# Altium schematic sheet integrated_driver_and_current_sense.SchDoc
size A3
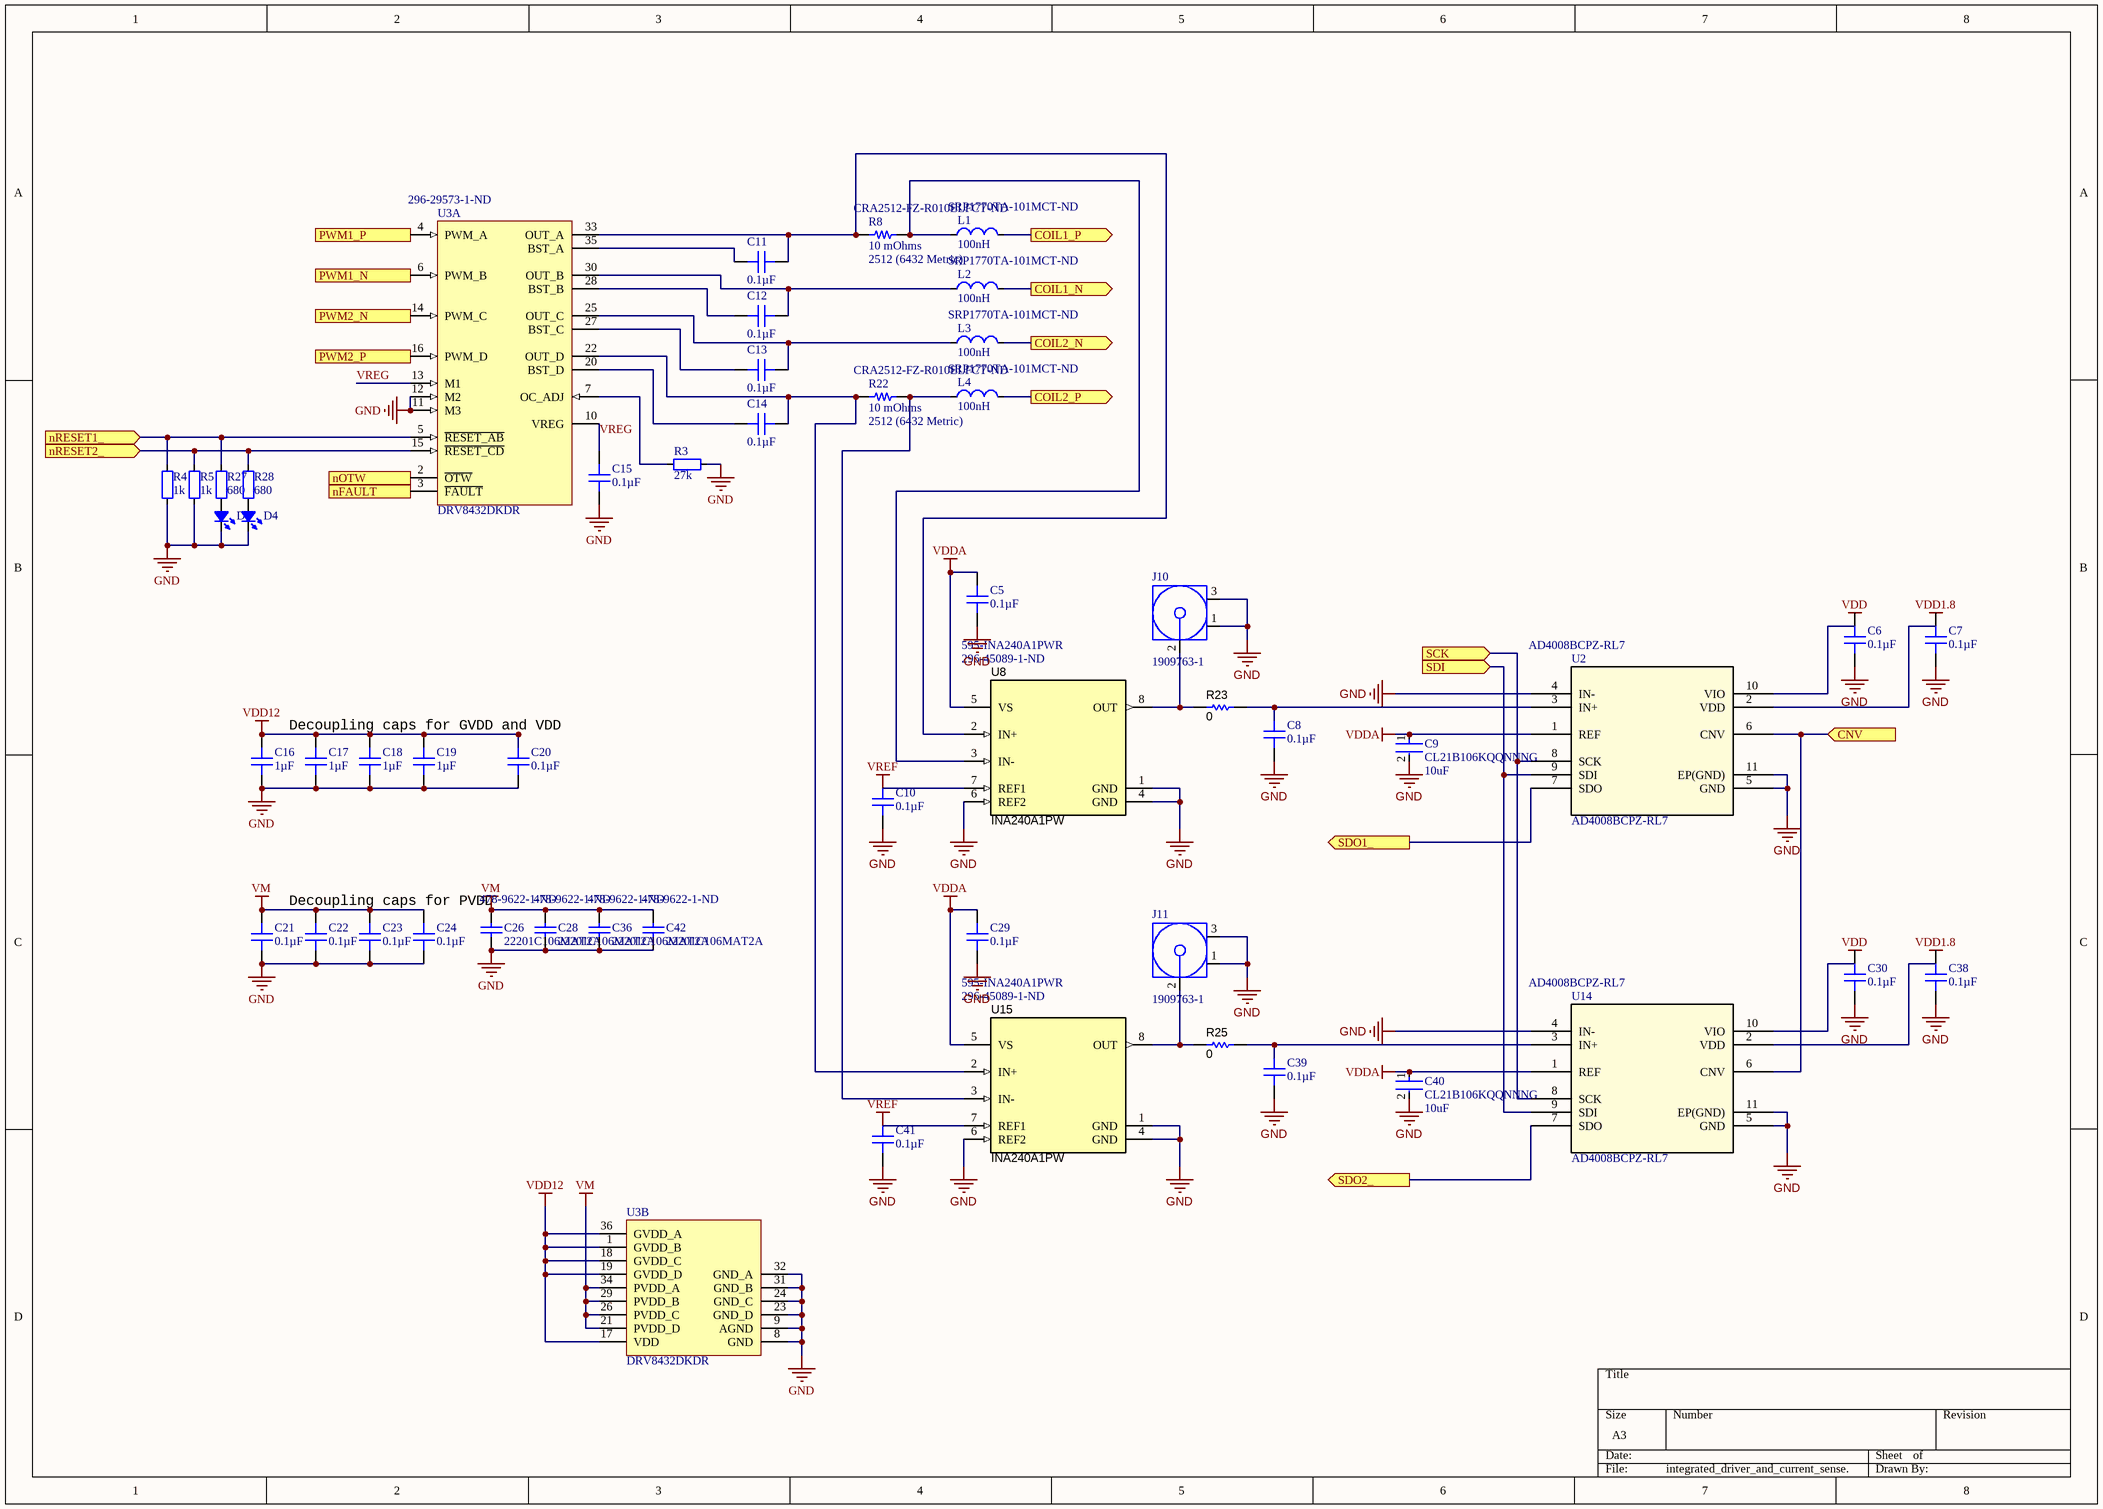
[diagram p0: integrated_driver_and_current_sense.SchDoc]

## Parts
C5  0.1µF  [CAP 0402_1005]
C6  0.1µF  [CAP 0402_1005]
C7  0.1µF  [CAP 0402_1005]
C8  0.1µF  [CAP 0402_1005]
C9  CL21B106KQQNNNG  Capacitance: 10uF  [FP-CL21-IPC_C]
C10  0.1µF  [CAP 0402_1005]
C11  0.1µF  [CAP 0603_1608]
C12  0.1µF  [CAP 0603_1608]
C13  0.1µF  [CAP 0603_1608]
C14  0.1µF  [CAP 0603_1608]
C15  0.1µF  [CAP 0402_1005]
C16  1µF  [CAP 0603_1608]
C17  1µF  [CAP 0603_1608]
C18  1µF  [CAP 0603_1608]
C19  1µF  [CAP 0603_1608]
C20  0.1µF  [CAP 0402_1005]
C21  0.1µF  [CAP 0603_1608]
C22  0.1µF  [CAP 0603_1608]
C23  0.1µF  [CAP 0603_1608]
C24  0.1µF  [CAP 0603_1608]
C26  22201C106MAT2A  Supplier Part Number 1: 478-9622-1-ND  [CAPC5750X279X64NL40T39]
C28  22201C106MAT2A  Supplier Part Number 1: 478-9622-1-ND  [CAPC5750X279X64NL40T39]
C29  0.1µF  [CAP 0402_1005]
C30  0.1µF  [CAP 0402_1005]
C36  22201C106MAT2A  Supplier Part Number 1: 478-9622-1-ND  [CAPC5750X279X64NL40T39]
C38  0.1µF  [CAP 0402_1005]
C39  0.1µF  [CAP 0402_1005]
C40  CL21B106KQQNNNG  Capacitance: 10uF  [FP-CL21-IPC_C]
C41  0.1µF  [CAP 0402_1005]
C42  22201C106MAT2A  Supplier Part Number 1: 478-9622-1-ND  [CAPC5750X279X64NL40T39]
D3  LED_0402  [LED_0402_RED]  (value not drawn)
D4  LED_0402  [LED_0402_RED]  (value not drawn)
J10  1909763-1  [TECO-1909763-1_V]
J11  1909763-1  [TECO-1909763-1_V]
L1  value 100nH  Supplier Part Number 1: SRP1770TA-101MCT-ND  [SRP1770TA]
L2  value 100nH  Supplier Part Number 1: SRP1770TA-101MCT-ND  [SRP1770TA]
L3  value 100nH  Supplier Part Number 1: SRP1770TA-101MCT-ND  [SRP1770TA]
L4  value 100nH  Supplier Part Number 1: SRP1770TA-101MCT-ND  [SRP1770TA]
R3  value 27k  [RES_0402]  (hidden comment: Res_0402)
R4  value 1k  [RES_0805]  (hidden comment: Res_0805)
R5  value 1k  [RES_0805]  (hidden comment: Res_0805)
R8  10 mOhms  Package / Case: 2512 (6432 Metric)  Supplier Part Number 1: CRA2512-FZ-R010ELFCT-ND  [STACKPOLE CSR2512]
R22  10 mOhms  Package / Case: 2512 (6432 Metric)  Supplier Part Number 1: CRA2512-FZ-R010ELFCT-ND  [STACKPOLE CSR2512]
R23  ValueDisplayed: 0  [RES_0402]  (hidden comment: CRCW04020000Z0ED)
R25  ValueDisplayed: 0  [RES_0402]  (hidden comment: CRCW04020000Z0ED)
R27  value 680  [RES_0402]  (hidden comment: Res_0402)
R28  value 680  [RES_0402]  (hidden comment: Res_0402)
U2  AD4008BCPZ-RL7  [CP_10_9]
U3  DRV8432DKDR  Supplier Part Number 1: 296-29573-1-ND  [DKD0036A_N]  (parts A,B of 2)
U8  INA240A1PW  Supplier Part Number 1: 296-45089-1-ND  Supplier Part Number 2: 595-INA240A1PWR  [PW0008A_N]
U14  AD4008BCPZ-RL7  [CP_10_9]
U15  INA240A1PW  Supplier Part Number 1: 296-45089-1-ND  Supplier Part Number 2: 595-INA240A1PWR  [PW0008A_N]

## Ports
CNV (in), COIL1_N (out), COIL1_P (out), COIL2_N (out), COIL2_P (out), nFAULT (out), nOTW (out), nRESET1_ (in), nRESET2_ (in), PWM1_N (in), PWM1_P (in), PWM2_N (in), PWM2_P (in), SCK (in), SDI (in), SDO1_ (out), SDO2_ (out)

## Nets
GND: C5.2 C6.2 C7.2 C8.2 C9.2 C10.2 C15.2 C16.2 C17.2 C18.2 C19.2 C20.2 C21.2 C22.2 C23.2 C24.2 C26.2 C28.2 C29.2 C30.2 C36.2 C38.2 C39.2 C40.2 C41.2 C42.2 D3.2(K) D4.2(K) J10.1 J10.3 J11.1 J11.3 R3.2 R4.1 R5.1 U2.4(IN-) U2.5(GND) U2.11(EP(GND)) U3.8(GND) U3.9(AGND) U3.11(M3) U3.12(M2) U3.23(GND_D) U3.24(GND_C) U3.31(GND_B) U3.32(GND_A) U8.1(GND) U8.4(GND) U8.6(REF2) U14.4(IN-) U14.5(GND) U14.11(EP(GND)) U15.1(GND) U15.4(GND) U15.6(REF2)
VDD: U2.10(VIO) U14.10(VIO)
VDD1.8: U2.2(VDD) U14.2(VDD)
VDD12: C16.1 C17.1 C18.1 C19.1 C20.1 U3.1(GVDD_B) U3.17(VDD) U3.18(GVDD_C) U3.19(GVDD_D) U3.36(GVDD_A)
VDDA: C5.1 C9.1 C29.1 C40.1 U2.1(REF) U8.5(VS) U14.1(REF) U15.5(VS)
VM: C21.1 C22.1 C23.1 C24.1 C26.1 C28.1 C36.1 C42.1 U3.21(PVDD_D) U3.26(PVDD_C) U3.29(PVDD_B) U3.34(PVDD_A)
VREF: U8.7(REF1) U15.7(REF1)
CNV: U2.6(CNV) U14.6(CNV) ; port CNV
COIL1_N: L2.2 ; port COIL1_N
COIL1_P: L1.2 ; port COIL1_P
COIL2_N: L3.2 ; port COIL2_N
COIL2_P: L4.2 ; port COIL2_P
nFAULT: U3.3(~{FAULT}) ; port nFAULT
nOTW: U3.2(~{OTW}) ; port nOTW
nRESET1_: R4.2 R27.2 U3.5(~{RESET_AB}) ; port nRESET1_
nRESET2_: R5.2 R28.2 U3.15(~{RESET_CD}) ; port nRESET2_
PWM1_N: U3.6(PWM_B) ; port PWM1_N
PWM1_P: U3.4(PWM_A) ; port PWM1_P
PWM2_N: U3.14(PWM_C) ; port PWM2_N
PWM2_P: U3.16(PWM_D) ; port PWM2_P
SCK: U2.8(SCK) U14.8(SCK) ; port SCK
SDI: U2.9(SDI) U14.9(SDI) ; port SDI
SDO1_: U2.7(SDO) ; port SDO1_
SDO2_: U14.7(SDO) ; port SDO2_
VREG: C15.1 U3.10(VREG) U3.13(M1)
NetC8_1: C8.1 R23.1 U2.3(IN+)
NetC11_1: C11.1 U3.35(BST_A)
NetC11_2: C11.2 R8.1 U3.33(OUT_A) U8.2(IN+)
NetC12_1: C12.1 U3.28(BST_B)
NetC12_2: C12.2 L2.1 U3.30(OUT_B)
NetC13_1: C13.1 U3.27(BST_C)
NetC13_2: C13.2 L3.1 U3.25(OUT_C)
NetC14_1: C14.1 U3.20(BST_D)
NetC14_2: C14.2 R22.1 U3.22(OUT_D) U15.2(IN+)
NetC39_1: C39.1 R25.1 U14.3(IN+)
NetD3_1: D3.1(A) R27.1
NetD4_1: D4.1(A) R28.1
NetJ10_2: J10.2 R23.2 U8.8(OUT)
NetJ11_2: J11.2 R25.2 U15.8(OUT)
NetL1_1: L1.1 R8.2 U8.3(IN-)
NetL4_1: L4.1 R22.2 U15.3(IN-)
NetR3_1: R3.1 U3.7(OC_ADJ)

Not connected (* = marked no-connect by the designer): C6 1; C7 1; C10 1; C30 1; C38 1; C41 1

## Notes on the sheet
- Decoupling caps for GVDD and VDD
- Decoupling caps for PVDD

## Library data of the parts
C5-C8 C10 C15 C20 C29 C30 C38 C39 C41 = 04023C104KAT2A: CAP CER 0.1UF 25V X7R 0402; Manufacturer: AVX Corporation; Tolerance: ±10%; Value: 0.1µF; ComponentLink1Description: Datasheet; ComponentLink1URL: http://datasheets.avx.com/X7RDielectric.pdf; Supplier 1: DigiKey; Supplier Part Number 1: 478-7868-1-ND; Part Number: 04023C104KAT2A; Applications: General Purpose; Capacitance: 0.1µF; ComponentLink2Description: DigiKey Link; ComponentLink2URL: http://digikey.com/product-detail/en/avx-corporation/04023C104KAT2A/478-7868-1-ND/3881491; Device Package: 0402 (1005 Metric); LastUpdated: 9/2/2020 1:02:21 AM; Lifecycle Status: Active; Minimum Order: 1; Mounting Type: Surface Mount, MLCC; Operating Temperature: -55°C ~ 125°C; Package / Case: 0402 (1005 Metric); Packaging: CutTape; PartId: 3190; Part Status: Active; Price: 0.13; Series: -; Size / Dimension: 0.039" L x 0.020" W (1.00mm x 0.50mm); Temperature Coefficient: X7R; Thickness (Max): 0.022" (0.55mm); Voltage - Rated: 25V
C9 C40 = CMP-13271-001427-1: CL21 Series 0805 10uF 6.3V ±10% Tolerance X7R Multilayer Ceramic Chip Capacitor; Min Operating Temperature: -55°C; Dielectric: X7R; Voltage Rating: 6.3V; Case/Package: 0805; Height: 1.25mm; Case Code (Metric): 2012; Tolerance: 10%; Packaging: Tape and Reel; Thickness: 0.055inch; Voltage: 6.3V; Max Operating Temperature: 125°C; Lead Free: Lead Free; Package Quantity: 3000; Case Code (Imperial): 0805; Depth: 1.25mm; Width: 0.049inch; Length: 2mm; Mount: Surface Mount
C11-C14 C21-C24 = 06031C104KAT2A: CAP CER 0.1UF 100V X7R 0603; Manufacturer: AVX Corporation; Tolerance: ±10%; Part Number: 06031C104KAT2A; Value: 0.1µF; Applications: General Purpose; Capacitance: 0.1µF; ComponentLink1Description: Datasheet; ComponentLink1URL: http://datasheets.avx.com/X7RDielectric.pdf; ComponentLink2Description: DigiKey Link; ComponentLink2URL: http://digikey.com/product-detail/en/avx-corporation/06031C104KAT2A/478-10047-1-ND/6564270; Device Package: 0603 (1608 Metric); LastUpdated: 9/2/2020 1:03:14 AM; Lifecycle Status: Active; Minimum Order: 1; Mounting Type: Surface Mount, MLCC; Operating Temperature: -55°C ~ 125°C; Package / Case: 0603 (1608 Metric); Packaging: TapeAndReel; PartId: 14077; Part Status: Active; Price: 0.03; Series: -; Size / Dimension: 0.063" L x 0.032" W (1.60mm x 0.81mm); Supplier 1: DigiKey; Supplier Part Number 1: 478-10047-1-ND; Temperature Coefficient: X7R; Thickness (Max): 0.037" (0.94mm); Voltage - Rated: 100V
C16-C19 = TMK107B7105KA-T: CAP CER 1UF 25V X7R 0603; Manufacturer: Taiyo Yuden; Tolerance: ±10%; Part Number: TMK107B7105KA-T; Value: 1µF; Applications: General Purpose; Capacitance: 1µF; ComponentLink1Description: Datasheet; ComponentLink1URL: https://www.yuden.co.jp/productdata/catalog/mlcc01_e.pdf; ComponentLink2Description: DigiKey Link; ComponentLink2URL: http://digikey.com/product-detail/en/taiyo-yuden/TMK107B7105KA-T/587-2984-1-ND/2714177; Device Package: 0603 (1608 Metric); LastUpdated: 9/2/2020 1:03:30 AM; Lifecycle Status: Active; Minimum Order: 1; Mounting Type: Surface Mount, MLCC; Operating Temperature: -55°C ~ 125°C; Package / Case: 0603 (1608 Metric); Packaging: TapeAndReel; PartId: 5586; Part Status: Active; Price: 0.01; Series: M; Size / Dimension: 0.063" L x 0.031" W (1.60mm x 0.80mm); Supplier 1: DigiKey; Supplier Part Number 1: 587-2984-1-ND; Temperature Coefficient: X7R; Thickness (Max): 0.035" (0.90mm); Voltage - Rated: 25V
C26 C28 C36 C42 = CMP-2000-07534-1: Chip Capacitor, 10 uF, +/- 20%, 100 V, -55 to 125 degC, 2220 (5750 Metric), RoHS, Tape and Reel; Manufacturer: AVX; Description: Cap Ceramic 10uF 100V X7R 20% SMD 2220 125°C Embossed T/R; Capacitance: 10uF; Voltage Rating: 100V; Dielectric: X7R; Datasheet URL: http://datasheets.avx.com/X7RDielectric.pdf; Package Reference: 2220; Package Description: 2-Pin Surface Mount Device, Body 5 x 5.7 mm; Datasheet Version: 03/2017; Manufacturer URL: http://www.avx.com/; Mounting Technology: SurfaceMount; Supplier 1: Digi-Key; Manufacturer Part Number: 22201C106MAT2A; RoHS: Yes; Category: Ceramic Capacitors; Stock 1: 186870; Pricing 1: 1=2.06000, 10=1.66400, 50=1.45200, 100=1.27050 (USD); Mount: Surface Mount; Case/Package: 2220; Case Code (Metric): 5750; Case Code (Imperial): 2220; Min Operating Temperature: -55°C; Max Operating Temperature: 125°C; Packaging: Tape and Reel; Tolerance: 20%; Voltage Rating (DC): 100V; Length: 0.224inch; Width: 0.197inch; Thickness: 0.11inch; RoHS Compliant: Yes; ComponentLink1URL: http://catalogs.avx.com/SurfaceMount.pdf?src-supplier=Digi-Key; ComponentLink1Description: http://catalogs.avx.com/SurfaceMount.pdf?src-supplier=Digi-Key
D3 D4 = LED_0402: LED
J10 J11 = CMP-2000-07505-1: Ultra Miniature Coaxial Connector Jack, 60 V, 50 Ohm, -40 to 90 degC, RoHS, Tape and Reel; Manufacturer: TE Connectivity; Gender: Female; PCB Mounting Orientation: Vertical; Body Material: LiquidCrystalPolymer; Case\/Package: SMD/SMT; Impedance: 50Ohm; Max Frequency: 6GHz; Body Plating: Gold; Dielectric Material: Polymer; Orientation: Straight; Mount: SurfaceMount; Length: 3mm; Packaging: TapeandReel; Connector Type: Jack; Lead Free: LeadFree; Package Quantity: 1; Termination: SMD/SMT; Contact Material: CopperAlloy; Fastening Type: Pull; RoHSCompliant: true; Max Operating Temperature: 90degC; Datasheet URL: http://www.te.com/commerce/DocumentDelivery/DDEController?Action=srchrtrv&DocNm=1909763&DocType=Customer+Drawing&DocLang=English; Contact Plating: Gold; Mounting Technology: SurfaceMount; Package Reference: TECO-1909763-1; Insulation Material: Thermoplastic; Min Operating Temperature: -40degC; Manufacturer URL: http://www.te.com/; ELV: Compliant; Datasheet Version: Rev. B2, 11/2015; Radiation Hardening: No; Package Description: 3-Pin Surface Mount Device, Body 2.6 x 2.6 mm; Housing Colour: Beige
L1-L4 = Ind_0805: FIXED IND 100UH 5.3A 118 MOHM; Manufacturer: TDK; Manufacturer Part Number: MPZ2012S300AT000; Core Material: Ferrite; Impedance: 30R; Current Rating: 6A; DC Resistance (DCR): 10mR; Saturation Current: 6.5A; Shielding: Shielded; Self Resonant Frequency: 2MHz; Test Frequency: 100kHz; Tolerance: 20%; Stock 1: 117704; Pricing 1: 1=0.11, 10=0.091, 25=0.0704, 50=0.0584, 100=0.0503, 250=0.04028, 500=0.03624, 1000=0.0302 (USD); Mount: Surface Mount; Case/Package: 0805; Number of Pins: 3; Case Code (Metric): 2012; Case Code (Imperial): 0805; Packaging: Tape and Reel; Package Quantity: 1; Max DC Current: 6A; Length: 0.079inch; Height: 0.041inch; Width: 0.049inch; Depth: 1.25mm; REACH SVHC: No SVHC; Lead Free: Lead Free; ComponentLink1URL: https://datasheet.ciiva.com/46381/1750041-46381644.pdf; ComponentLink1Description: https://datasheet.ciiva.com/46381/1750041-46381644.pdf; ComponentLink2URL: https://datasheet.ciiva.com/48682/beads-commercial-power-mpz-en-48682508.pdf; ComponentLink2Description: https://datasheet.ciiva.com/48682/beads-commercial-power-mpz-en-48682508.pdf; ComponentLink3URL: https://datasheet.ciiva.com/8077/55169-8077085.pdf; ComponentLink3Description: https://datasheet.ciiva.com/8077/55169-8077085.pdf; ComponentLink4URL: https://datasheet.ciiva.com/8077/55169-8077086.pdf; ComponentLink4Description: https://datasheet.ciiva.com/8077/55169-8077086.pdf; ComponentLink5URL: https://datasheet.ciiva.com/46634/beads-commercial-power-mpz-en-46634590.pdf; ComponentLink5Description: https://datasheet.ciiva.com/46634/beads-commercial-power-mpz-en-46634590.pdf; ComponentLink6URL: https://datasheet.ciiva.com/46634/beads-commercial-power-mpz-en-46634367.pdf; ComponentLink6Description: https://datasheet.ciiva.com/46634/beads-commercial-power-mpz-en-46634367.pdf; RoHS: Yes; Category: Fixed Inductors; Stock 2: 17; Pricing 2: 1=4.17000, 10=3.82200, 25=3.47520, 50=2.91900, 100=2.50200 (USD); Min Operating Temperature: -40°C; Max Operating Temperature: 150°C; Resistor Type: Wirewound; Inductance: 100uH; RMS Current (Irms): 5.3A; Inductance Tolerance: 20%; Height - Seated (Max): 0.276inch; Ratings: AEC-Q200; RoHS Compliant: Yes; ComponentLink7URL: http://www.farnell.com/datasheets/2360566.pdf?src-supplier=Farnell; ComponentLink7Description: http://www.farnell.com/datasheets/2360566.pdf?src-supplier=Farnell; ComponentLink8URL: http://www.farnell.com/datasheets/1955470.pdf?src-supplier=Element14; ComponentLink8Description: http://www.farnell.com/datasheets/1955470.pdf?src-supplier=Element14; ComponentLink9URL: http://www.bourns.com/docs/Product-Datasheets/SRP1770TA.pdf?src-supplier=Digi-Key; ComponentLink9Description: http://www.bourns.com/docs/Product-Datasheets/SRP1770TA.pdf?src-supplier=Digi-Key; ComponentLink10URL: https://www.bourns.com/docs/Product-Datasheets/SRP1770TA.pdf?src-supplier=Digi-Key; ComponentLink10Description: https://www.bourns.com/docs/Product-Datasheets/SRP1770TA.pdf?src-supplier=Digi-Key; Supplier 1: Digi-Key
R3 R27 R28 = Res_0402: Resistor
R4 R5 = Res_0805: Resistor
R8 R22 = TLR3A20ER010FTDG: RES 0.01 OHM 1% 2W 2512; Manufacturer: TE Connectivity Passive Product; Temperature Coefficient: ±100ppm/°C; Part Number: TLR3A20ER010FTDG; ComponentLink1Description: Datasheet; ComponentLink1URL: https://www.te.com/commerce/DocumentDelivery/DDEController?Action=srchrtrv&DocNm=1773449-3&DocType=DS&DocLang=English; ComponentLink2Description: DigiKey Link; ComponentLink2URL: http://digikey.com/product-detail/en/te-connectivity-passive-product/TLR3A20ER010FTDG/A129568CT-ND/8566772; Composition: Metal Foil; Device Package: 2512 (6432 Metric); Features: Current Sense; Height - Seated (Max): 0.024" (0.60mm); LastUpdated: 9/2/2020 1:18:04 AM; Lifecycle Status: Active; Minimum Order: 1; Number of Terminations: 2; Operating Temperature: -55°C ~ 170°C; Packaging: TapeAndReel; PartId: 1895; Part Status: Active; Power (Watts): 2W; Price: 0.30; Resistance: 10 mOhms; Series: TLR, CGS; Size / Dimension: 0.252" L x 0.126" W (6.40mm x 3.20mm); Supplier Device Package: 2512; Tolerance: ±1%; Value: 10 mOhms; Supplier 1: Digi-Key
R23 R25 = CRCW04020000Z0ED: RES, 0, 5%, 0.063 W, 0402; Manufacturer: Vishay-Dale; CompType: Resistor; Value: 0; Value_Code: 0000; Tolerance_%: 5; Power_W: 0.063; Value2: 0.063W; VDC_V: 50; TempCo: 200 ppm/C; SizeArea_mm2: 0.5; SizeX_mm: 1; SizeZ_mm: 0.6; EIA_Code: E24; U/M: EA; AEC Category: Q200; SymbolVersion: 2009-05-29; PartNumber: CRCW04020000Z0ED; PackageReference: 0402; RoHS: Y; Res_ohm: 0; Value1: 5%; MountType: SMT; Technology: Thick Film; SizeY_mm: 0.5; Published: 2008-06-26; Publisher: Texas Instruments; LatestRevisionDate: 2016-07-14; ComponentLink1Description: Datasheet link; ComponentLink1URL: http://www.vishay.com/docs/20035/dcrcwe3.pdf; Supplier 1: Digi-Key; Supplier Part Number 1: 541-0.0JCT-ND; Supplier 2: Mouser; Supplier Part Number 2: 71-CRCW0402-0-E3; Supplier 3: Farnell; Supplier Part Number 3: 1469661; AEC Qualified: ?
U2 U14 = AD4008BCPZ-RL7: 16-Bit, 2 MSPS/1 MSPS/500 kSPS, / Precision, Pseudo Differential, SAR ADCs; Value: Value; Type: Type; RefDes: RefDes; Supplier 1: Arrow Electronics; Supplier Part Number 1: AD4008BCPZ-RL7
U3 = CMP-1556-00009-2: 12 A Dual Brushed DC or Single Bipolar Stepper Motor Driver (PWM Ctrl), 0 to 52.5 V, -40 to 85 degC, 36-pin SOP (DKD36), Green (RoHS & no Sb/Br); Manufacturer: Texas Instruments; Vs(Min)(V): 0; rDS (ON) (LS + HS)(mOhms): 220; RMS Output Current(A): 7; Vs(Max)(V): 52.5; Peak Output Current(A): 12; Description: TEXAS INSTRUMENTS - DRV8432DKDR - MOTOR CONTROLLER, FULL BRIDGE, HSSOP-36; Operating Supply Voltage: 50V; Output Current: 7A; Max Supply Voltage: 52.5V; Min Supply Voltage: 0V; Number of Outputs: 2; Nominal Supply Current: 10.5mA; Power Dissipation: 5W; Max Output Current: 12A; Fault Protection: Over Temperature,Short Circuit; DatasheetVersion: SLES242D; ComponentLink1URL: http://www.ti.com/; ComponentLink1Description: Manufacturer URL; PackageVersion: 4204421-2/K, 11/2013; ComponentLink3Description: Package Specification; Package Reference: DKD0036A; ComponentLink2Description: Datasheet; PackageDescription: 36-Pin Plastic Small Outline, Body 15.9 x 11 mm, Pitch 0.65 mm; Control I/F: PWM; Eco-Plan: Green (RoHS & no Sb/Br); Mounting Technology: Surface Mount; ComponentLink2URL: http://www.ti.com/general/docs/lit/getliterature.tsp?genericPartNumber=DRV8432&fileType=pdf; PartNumber: DRV8432DKDR; ComponentLink3URL: http://www.ti.com/lit/ml/mpds126j/mpds126j.pdf; Supplier 1: Digi-Key; Manufacturer Part Number: DRV8432DKDR; RoHS: Yes; Category: Amplifiers - Audio; Stock 1: 927; Pricing 1: 1=12.21000, 10=11.03000, 25=10.51720, 100=8.72170, 250=7.95212 (USD); Mount: Surface Mount; Case/Package: HSSOP; Number of Pins: 36; Min Operating Temperature: -40°C; Max Operating Temperature: 85°C; Package Quantity: 500; Packaging: Tape and Reel; Supply Current: 10.5mA; Series: DRV8432; Interface: PWM; Output Current per Channel: 7A; Radiation Hardening: No; Lead Free: Lead Free; RoHS Compliant: Yes; ComponentLink4URL: https://datasheet.ciiva.com/15109/getdatasheetpartid-482142-15109561.pdf?src-supplier=Verical; ComponentLink4Description: https://datasheet.ciiva.com/15109/getdatasheetpartid-482142-15109561.pdf?src-supplier=Verical; ComponentLink5URL: https://datasheet.ciiva.com/1959/drv8432-1959978.pdf?src-supplier=Digi-Key; ComponentLink5Description: https://datasheet.ciiva.com/1959/drv8432-1959978.pdf?src-supplier=Digi-Key; ComponentLink6URL: https://datasheet.ciiva.com/41457/001013555-da-01-en-ic-bridge-driver-drv8432dkdr-ssop-36-tid-41457289.pdf?src-supplier=Conrad; ComponentLink6Description: https://datasheet.ciiva.com/41457/001013555-da-01-en-ic-bridge-driver-drv8432dkdr-ssop-36-tid-41457289.pdf?src-supplier=Conrad; ComponentLink7URL: https://datasheet.ciiva.com/3228/drv8432-3228999.pdf?src-supplier=Avnet; ComponentLink7Description: https://datasheet.ciiva.com/3228/drv8432-3228999.pdf?src-supplier=Avnet; ComponentLink8URL: https://datasheet.ciiva.com/1959/drv8432-1959979.pdf?src-supplier=Digi-Key; ComponentLink8Description: https://datasheet.ciiva.com/1959/drv8432-1959979.pdf?src-supplier=Digi-Key; ComponentLink9URL: https://datasheet.ciiva.com/1959/drv8432-1959980.pdf?src-supplier=Digi-Key; ComponentLink9Description: https://datasheet.ciiva.com/1959/drv8432-1959980.pdf?src-supplier=Digi-Key
U8 U15 = INA240A1PW: TEXAS INSTRUMENTS - INA240A1PWR . - CURRENT SENSE AMPLIFIER, 400KHZ, TSSOP-8; SymbolCreator: Altium; CompType: IC; U/M: EA; Number of Circuits: 1; Slew Rate: 2V/µs; Input Bias Current: 90uA; Input Offset Voltage (Vos): 5uV; Operating Supply Current: 1.8mA; SymbolVersion: 2016-01-07; PartNumber: INA240A1PW; PackageReference: PW0008A; MountType: SMT; ComponentLink1Description: Datasheet Link; ComponentLink1URL: https://sps06.itg.ti.com/sites/KMS/crossdivteams/altium/docs/ComponentDatasheets/INA240 Prelim DS - 9-15-15.pdf; Publisher: Texas Instruments; LatestRevisionDate: 2016-03-14; Manufacturer: Texas Instruments; Alternate Manufacturer: Texas Instruments; Manufacturer Part Number: INA240A1PWR; Category: Amplifiers - Op Amps, Buffer, Instrumentation; Stock 1: 14825; Pricing 1: 1=2.78000, 10=2.50000, 50=2.37000, 100=1.95000, 1000=1.40000, 10000=1.34000 (USD); Mount: Surface Mount; Case/Package: TSSOP; Min Operating Temperature: -40°C; Max Operating Temperature: 125°C; Packaging: Tape and Reel; -3db Bandwidth: 400kHz; RoHS Compliant: Yes; Lead Free: Lead Free; ComponentLink2URL: http://www.ti.com/lit/ds/symlink/ina240.pdf?src-supplier=Farnell; ComponentLink2Description: http://www.ti.com/lit/ds/symlink/ina240.pdf?src-supplier=Farnell; ComponentLink3URL: http://www.ti.com/lit/ds/symlink/ina240.pdf?src-supplier=Digi-Key; ComponentLink3Description: http://www.ti.com/lit/ds/symlink/ina240.pdf?src-supplier=Digi-Key; ComponentLink4URL: http://www.ti.com/lit/ds/symlink/ina240.pdf?src-supplier=Newark; ComponentLink4Description: http://www.ti.com/lit/ds/symlink/ina240.pdf?src-supplier=Newark; Supplier 1: Digi-Key; Supplier 2: Mouser